# Vivado block design ps, xc7z020clg484-1, Vivado 2017.1
# (continued, part 3 of 4)
current_bd_instance /RX/rx_10

# ---- hierarchy /RX/rx_11 ----
current_bd_instance /RX/rx_11
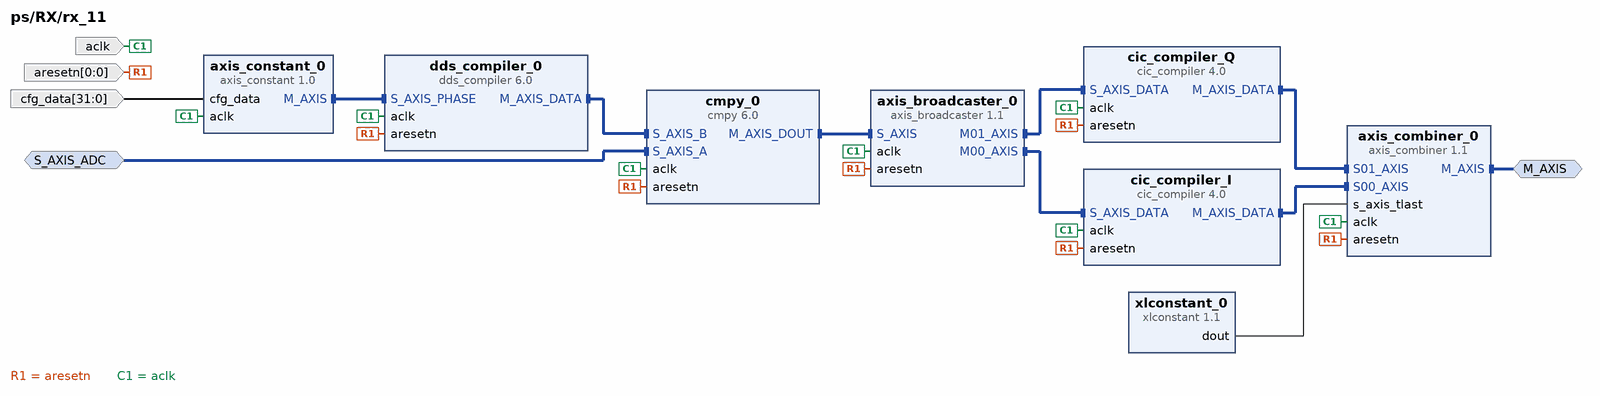
[diagram p17: block diagram inside /RX/rx_11]
create_bd_intf_pin -mode Slave -vlnv xilinx.com:interface:axis_rtl:1.0 S_AXIS_ADC
create_bd_intf_pin -mode Master -vlnv xilinx.com:interface:axis_rtl:1.0 M_AXIS
create_bd_pin -dir I aclk
create_bd_pin -dir I -from 0 -to 0 aresetn
create_bd_pin -dir I -from 31 -to 0 cfg_data

create_bd_cell -type ip -vlnv pavel-demin:user:axis_constant:1.0 axis_constant_0
create_bd_cell -type ip -vlnv xilinx.com:ip:axis_broadcaster:1.1 axis_broadcaster_0
set_property -dict [list \
  CONFIG.M_TDATA_NUM_BYTES 3 \
  CONFIG.S_TDATA_NUM_BYTES 8 \
  CONFIG.M00_TDATA_REMAP {tdata[23:0]} \
  CONFIG.M01_TDATA_REMAP {tdata[55:32]} \
] [get_bd_cells axis_broadcaster_0]
create_bd_cell -type ip -vlnv xilinx.com:ip:axis_combiner:1.1 axis_combiner_0
set_property -dict {CONFIG.TDATA_NUM_BYTES 3 CONFIG.HAS_TLAST 1} [get_bd_cells axis_combiner_0]
create_bd_cell -type ip -vlnv xilinx.com:ip:cic_compiler:4.0 cic_compiler_I
set_property -dict [list \
  CONFIG.Filter_Type Decimation \
  CONFIG.Number_Of_Stages 5 \
  CONFIG.Fixed_Or_Initial_Rate 32 \
  CONFIG.Minimum_Rate 32 \
  CONFIG.Maximum_Rate 32 \
  CONFIG.Input_Sample_Frequency 125 \
  CONFIG.Clock_Frequency 125 \
  CONFIG.SamplePeriod 1 \
  CONFIG.Input_Data_Width 24 \
  CONFIG.Quantization Truncation \
  CONFIG.Output_Data_Width 24 \
  CONFIG.Use_Xtreme_DSP_Slice false \
  CONFIG.HAS_ARESETN true \
  CONFIG.HAS_DOUT_TREADY true \
] [get_bd_cells cic_compiler_I]
create_bd_cell -type ip -vlnv xilinx.com:ip:cic_compiler:4.0 cic_compiler_Q
set_property -dict [list \
  CONFIG.Filter_Type Decimation \
  CONFIG.Number_Of_Stages 5 \
  CONFIG.Fixed_Or_Initial_Rate 32 \
  CONFIG.Minimum_Rate 32 \
  CONFIG.Maximum_Rate 32 \
  CONFIG.Input_Sample_Frequency 125 \
  CONFIG.Clock_Frequency 125 \
  CONFIG.SamplePeriod 1 \
  CONFIG.Input_Data_Width 24 \
  CONFIG.Quantization Truncation \
  CONFIG.Output_Data_Width 24 \
  CONFIG.Use_Xtreme_DSP_Slice false \
  CONFIG.HAS_ARESETN true \
  CONFIG.HAS_DOUT_TREADY true \
] [get_bd_cells cic_compiler_Q]
create_bd_cell -type ip -vlnv xilinx.com:ip:cmpy:6.0 cmpy_0
set_property -dict [list \
  CONFIG.APortWidth 16 \
  CONFIG.BPortWidth 24 \
  CONFIG.FlowControl Blocking \
  CONFIG.RoundMode Truncate \
  CONFIG.OutputWidth 25 \
  CONFIG.MinimumLatency 9 \
  CONFIG.ARESETN true \
] [get_bd_cells cmpy_0]
create_bd_cell -type ip -vlnv xilinx.com:ip:dds_compiler:6.0 dds_compiler_0
set_property -dict [list \
  CONFIG.DDS_Clock_Rate 125 \
  CONFIG.Spurious_Free_Dynamic_Range 138 \
  CONFIG.Frequency_Resolution 0.2 \
  CONFIG.Noise_Shaping Auto \
  CONFIG.Phase_Width 30 \
  CONFIG.Output_Width 24 \
  CONFIG.Phase_Increment Streaming \
  CONFIG.Negative_Sine true \
  CONFIG.Has_Phase_Out false \
  CONFIG.DATA_Has_TLAST Not_Required \
  CONFIG.Has_TREADY true \
  CONFIG.S_PHASE_Has_TUSER Not_Required \
  CONFIG.M_DATA_Has_TUSER Not_Required \
  CONFIG.Latency 16 \
  CONFIG.Has_ARESETn true \
  CONFIG.Output_Frequency1 0 \
  CONFIG.PINC1 0 \
] [get_bd_cells dds_compiler_0]
create_bd_cell -type ip -vlnv xilinx.com:ip:xlconstant:1.1 xlconstant_0
set_property -dict {CONFIG.CONST_WIDTH 2 CONFIG.CONST_VAL 2} [get_bd_cells xlconstant_0]

# ---- hierarchy /RX/rx_12 ----
current_bd_instance /RX/rx_12
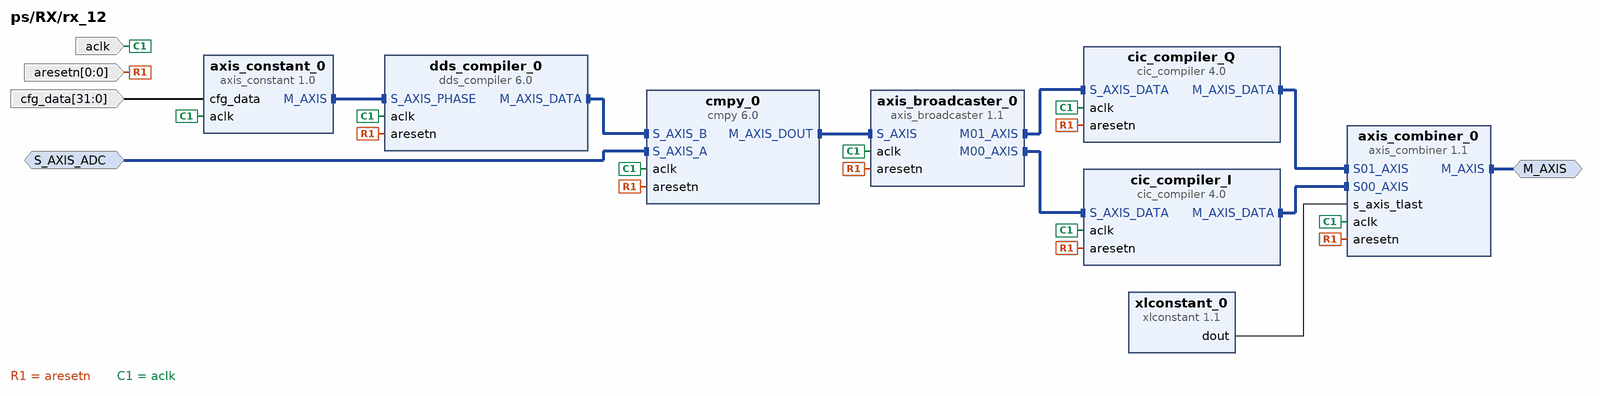
[diagram p18: block diagram inside /RX/rx_12]
create_bd_intf_pin -mode Slave -vlnv xilinx.com:interface:axis_rtl:1.0 S_AXIS_ADC
create_bd_intf_pin -mode Master -vlnv xilinx.com:interface:axis_rtl:1.0 M_AXIS
create_bd_pin -dir I aclk
create_bd_pin -dir I -from 0 -to 0 aresetn
create_bd_pin -dir I -from 31 -to 0 cfg_data

create_bd_cell -type ip -vlnv pavel-demin:user:axis_constant:1.0 axis_constant_0
create_bd_cell -type ip -vlnv xilinx.com:ip:axis_broadcaster:1.1 axis_broadcaster_0
set_property -dict [list \
  CONFIG.M_TDATA_NUM_BYTES 3 \
  CONFIG.S_TDATA_NUM_BYTES 8 \
  CONFIG.M00_TDATA_REMAP {tdata[23:0]} \
  CONFIG.M01_TDATA_REMAP {tdata[55:32]} \
] [get_bd_cells axis_broadcaster_0]
create_bd_cell -type ip -vlnv xilinx.com:ip:axis_combiner:1.1 axis_combiner_0
set_property -dict {CONFIG.TDATA_NUM_BYTES 3 CONFIG.HAS_TLAST 1} [get_bd_cells axis_combiner_0]
create_bd_cell -type ip -vlnv xilinx.com:ip:cic_compiler:4.0 cic_compiler_I
set_property -dict [list \
  CONFIG.Filter_Type Decimation \
  CONFIG.Number_Of_Stages 5 \
  CONFIG.Fixed_Or_Initial_Rate 32 \
  CONFIG.Minimum_Rate 32 \
  CONFIG.Maximum_Rate 32 \
  CONFIG.Input_Sample_Frequency 125 \
  CONFIG.Clock_Frequency 125 \
  CONFIG.SamplePeriod 1 \
  CONFIG.Input_Data_Width 24 \
  CONFIG.Quantization Truncation \
  CONFIG.Output_Data_Width 24 \
  CONFIG.Use_Xtreme_DSP_Slice false \
  CONFIG.HAS_ARESETN true \
  CONFIG.HAS_DOUT_TREADY true \
] [get_bd_cells cic_compiler_I]
create_bd_cell -type ip -vlnv xilinx.com:ip:cic_compiler:4.0 cic_compiler_Q
set_property -dict [list \
  CONFIG.Filter_Type Decimation \
  CONFIG.Number_Of_Stages 5 \
  CONFIG.Fixed_Or_Initial_Rate 32 \
  CONFIG.Minimum_Rate 32 \
  CONFIG.Maximum_Rate 32 \
  CONFIG.Input_Sample_Frequency 125 \
  CONFIG.Clock_Frequency 125 \
  CONFIG.SamplePeriod 1 \
  CONFIG.Input_Data_Width 24 \
  CONFIG.Quantization Truncation \
  CONFIG.Output_Data_Width 24 \
  CONFIG.Use_Xtreme_DSP_Slice false \
  CONFIG.HAS_ARESETN true \
  CONFIG.HAS_DOUT_TREADY true \
] [get_bd_cells cic_compiler_Q]
create_bd_cell -type ip -vlnv xilinx.com:ip:cmpy:6.0 cmpy_0
set_property -dict [list \
  CONFIG.APortWidth 16 \
  CONFIG.BPortWidth 24 \
  CONFIG.FlowControl Blocking \
  CONFIG.RoundMode Truncate \
  CONFIG.OutputWidth 25 \
  CONFIG.MinimumLatency 9 \
  CONFIG.ARESETN true \
] [get_bd_cells cmpy_0]
create_bd_cell -type ip -vlnv xilinx.com:ip:dds_compiler:6.0 dds_compiler_0
set_property -dict [list \
  CONFIG.DDS_Clock_Rate 125 \
  CONFIG.Spurious_Free_Dynamic_Range 138 \
  CONFIG.Frequency_Resolution 0.2 \
  CONFIG.Noise_Shaping Auto \
  CONFIG.Phase_Width 30 \
  CONFIG.Output_Width 24 \
  CONFIG.Phase_Increment Streaming \
  CONFIG.Negative_Sine true \
  CONFIG.Has_Phase_Out false \
  CONFIG.DATA_Has_TLAST Not_Required \
  CONFIG.Has_TREADY true \
  CONFIG.S_PHASE_Has_TUSER Not_Required \
  CONFIG.M_DATA_Has_TUSER Not_Required \
  CONFIG.Latency 16 \
  CONFIG.Has_ARESETn true \
  CONFIG.Output_Frequency1 0 \
  CONFIG.PINC1 0 \
] [get_bd_cells dds_compiler_0]
create_bd_cell -type ip -vlnv xilinx.com:ip:xlconstant:1.1 xlconstant_0
set_property -dict {CONFIG.CONST_WIDTH 2 CONFIG.CONST_VAL 2} [get_bd_cells xlconstant_0]

# ---- hierarchy /RX/rx_13 ----
current_bd_instance /RX/rx_13
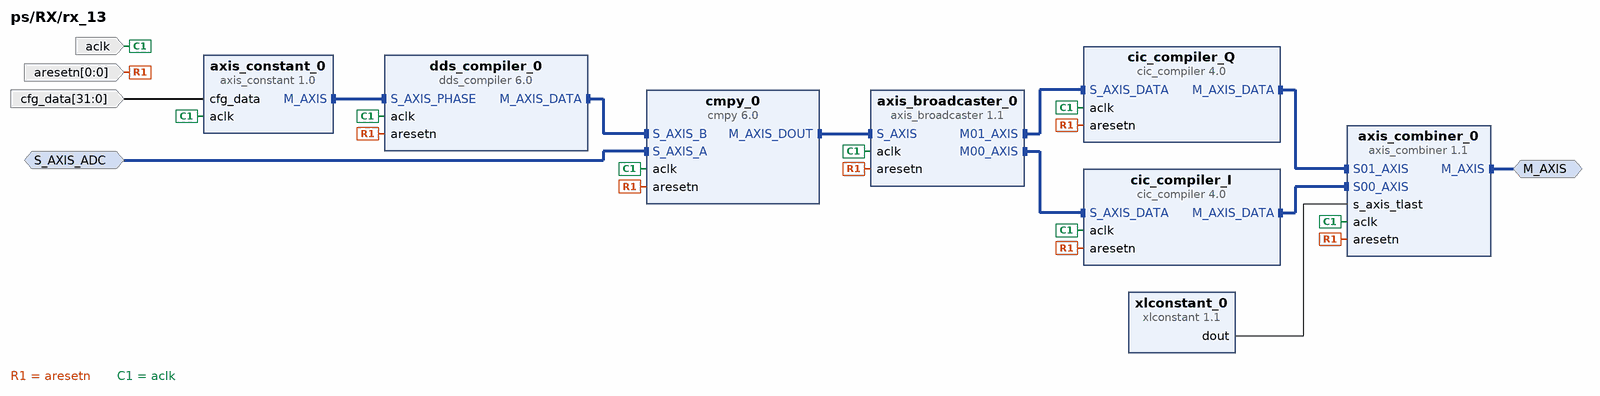
[diagram p19: block diagram inside /RX/rx_13]
create_bd_intf_pin -mode Slave -vlnv xilinx.com:interface:axis_rtl:1.0 S_AXIS_ADC
create_bd_intf_pin -mode Master -vlnv xilinx.com:interface:axis_rtl:1.0 M_AXIS
create_bd_pin -dir I aclk
create_bd_pin -dir I -from 0 -to 0 aresetn
create_bd_pin -dir I -from 31 -to 0 cfg_data

create_bd_cell -type ip -vlnv pavel-demin:user:axis_constant:1.0 axis_constant_0
create_bd_cell -type ip -vlnv xilinx.com:ip:axis_broadcaster:1.1 axis_broadcaster_0
set_property -dict [list \
  CONFIG.M_TDATA_NUM_BYTES 3 \
  CONFIG.S_TDATA_NUM_BYTES 8 \
  CONFIG.M00_TDATA_REMAP {tdata[23:0]} \
  CONFIG.M01_TDATA_REMAP {tdata[55:32]} \
] [get_bd_cells axis_broadcaster_0]
create_bd_cell -type ip -vlnv xilinx.com:ip:axis_combiner:1.1 axis_combiner_0
set_property -dict {CONFIG.TDATA_NUM_BYTES 3 CONFIG.HAS_TLAST 1} [get_bd_cells axis_combiner_0]
create_bd_cell -type ip -vlnv xilinx.com:ip:cic_compiler:4.0 cic_compiler_I
set_property -dict [list \
  CONFIG.Filter_Type Decimation \
  CONFIG.Number_Of_Stages 5 \
  CONFIG.Fixed_Or_Initial_Rate 32 \
  CONFIG.Minimum_Rate 32 \
  CONFIG.Maximum_Rate 32 \
  CONFIG.Input_Sample_Frequency 125 \
  CONFIG.Clock_Frequency 125 \
  CONFIG.SamplePeriod 1 \
  CONFIG.Input_Data_Width 24 \
  CONFIG.Quantization Truncation \
  CONFIG.Output_Data_Width 24 \
  CONFIG.Use_Xtreme_DSP_Slice false \
  CONFIG.HAS_ARESETN true \
  CONFIG.HAS_DOUT_TREADY true \
] [get_bd_cells cic_compiler_I]
create_bd_cell -type ip -vlnv xilinx.com:ip:cic_compiler:4.0 cic_compiler_Q
set_property -dict [list \
  CONFIG.Filter_Type Decimation \
  CONFIG.Number_Of_Stages 5 \
  CONFIG.Fixed_Or_Initial_Rate 32 \
  CONFIG.Minimum_Rate 32 \
  CONFIG.Maximum_Rate 32 \
  CONFIG.Input_Sample_Frequency 125 \
  CONFIG.Clock_Frequency 125 \
  CONFIG.SamplePeriod 1 \
  CONFIG.Input_Data_Width 24 \
  CONFIG.Quantization Truncation \
  CONFIG.Output_Data_Width 24 \
  CONFIG.Use_Xtreme_DSP_Slice false \
  CONFIG.HAS_ARESETN true \
  CONFIG.HAS_DOUT_TREADY true \
] [get_bd_cells cic_compiler_Q]
create_bd_cell -type ip -vlnv xilinx.com:ip:cmpy:6.0 cmpy_0
set_property -dict [list \
  CONFIG.APortWidth 16 \
  CONFIG.BPortWidth 24 \
  CONFIG.FlowControl Blocking \
  CONFIG.RoundMode Truncate \
  CONFIG.OutputWidth 25 \
  CONFIG.MinimumLatency 9 \
  CONFIG.ARESETN true \
] [get_bd_cells cmpy_0]
create_bd_cell -type ip -vlnv xilinx.com:ip:dds_compiler:6.0 dds_compiler_0
set_property -dict [list \
  CONFIG.DDS_Clock_Rate 125 \
  CONFIG.Spurious_Free_Dynamic_Range 138 \
  CONFIG.Frequency_Resolution 0.2 \
  CONFIG.Noise_Shaping Auto \
  CONFIG.Phase_Width 30 \
  CONFIG.Output_Width 24 \
  CONFIG.Phase_Increment Streaming \
  CONFIG.Negative_Sine true \
  CONFIG.Has_Phase_Out false \
  CONFIG.DATA_Has_TLAST Not_Required \
  CONFIG.Has_TREADY true \
  CONFIG.S_PHASE_Has_TUSER Not_Required \
  CONFIG.M_DATA_Has_TUSER Not_Required \
  CONFIG.Latency 16 \
  CONFIG.Has_ARESETn true \
  CONFIG.Output_Frequency1 0 \
  CONFIG.PINC1 0 \
] [get_bd_cells dds_compiler_0]
create_bd_cell -type ip -vlnv xilinx.com:ip:xlconstant:1.1 xlconstant_0
set_property -dict {CONFIG.CONST_WIDTH 2 CONFIG.CONST_VAL 2} [get_bd_cells xlconstant_0]

# ---- hierarchy /RX/rx_14 ----
current_bd_instance /RX/rx_14
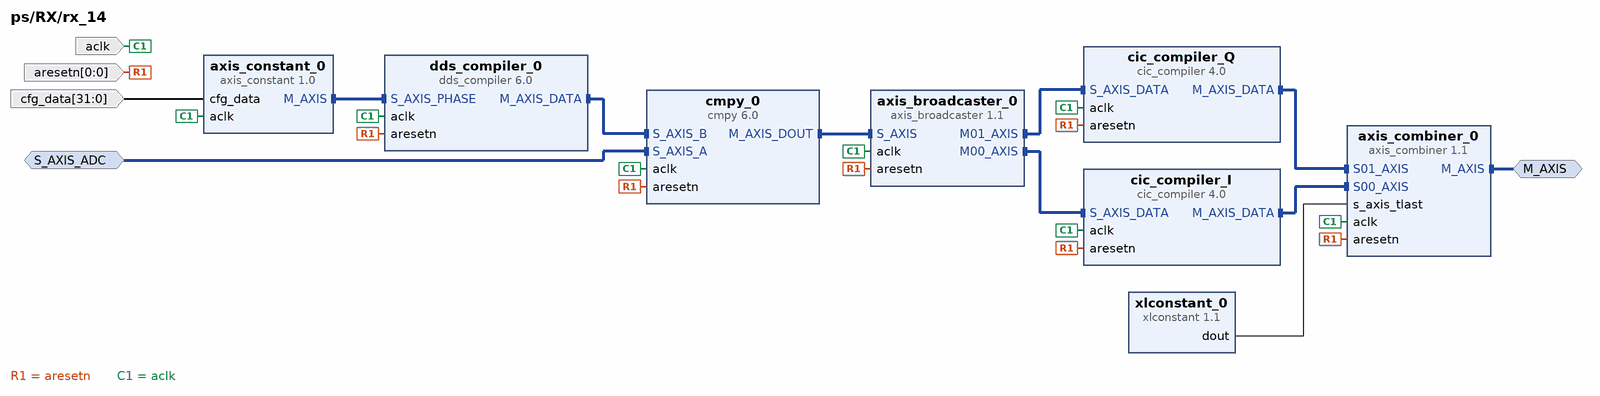
[diagram p20: block diagram inside /RX/rx_14]
create_bd_intf_pin -mode Slave -vlnv xilinx.com:interface:axis_rtl:1.0 S_AXIS_ADC
create_bd_intf_pin -mode Master -vlnv xilinx.com:interface:axis_rtl:1.0 M_AXIS
create_bd_pin -dir I aclk
create_bd_pin -dir I -from 0 -to 0 aresetn
create_bd_pin -dir I -from 31 -to 0 cfg_data

create_bd_cell -type ip -vlnv pavel-demin:user:axis_constant:1.0 axis_constant_0
create_bd_cell -type ip -vlnv xilinx.com:ip:axis_broadcaster:1.1 axis_broadcaster_0
set_property -dict [list \
  CONFIG.M_TDATA_NUM_BYTES 3 \
  CONFIG.S_TDATA_NUM_BYTES 8 \
  CONFIG.M00_TDATA_REMAP {tdata[23:0]} \
  CONFIG.M01_TDATA_REMAP {tdata[55:32]} \
] [get_bd_cells axis_broadcaster_0]
create_bd_cell -type ip -vlnv xilinx.com:ip:axis_combiner:1.1 axis_combiner_0
set_property -dict {CONFIG.TDATA_NUM_BYTES 3 CONFIG.HAS_TLAST 1} [get_bd_cells axis_combiner_0]
create_bd_cell -type ip -vlnv xilinx.com:ip:cic_compiler:4.0 cic_compiler_I
set_property -dict [list \
  CONFIG.Filter_Type Decimation \
  CONFIG.Number_Of_Stages 5 \
  CONFIG.Fixed_Or_Initial_Rate 32 \
  CONFIG.Minimum_Rate 32 \
  CONFIG.Maximum_Rate 32 \
  CONFIG.Input_Sample_Frequency 125 \
  CONFIG.Clock_Frequency 125 \
  CONFIG.SamplePeriod 1 \
  CONFIG.Input_Data_Width 24 \
  CONFIG.Quantization Truncation \
  CONFIG.Output_Data_Width 24 \
  CONFIG.Use_Xtreme_DSP_Slice false \
  CONFIG.HAS_ARESETN true \
  CONFIG.HAS_DOUT_TREADY true \
] [get_bd_cells cic_compiler_I]
create_bd_cell -type ip -vlnv xilinx.com:ip:cic_compiler:4.0 cic_compiler_Q
set_property -dict [list \
  CONFIG.Filter_Type Decimation \
  CONFIG.Number_Of_Stages 5 \
  CONFIG.Fixed_Or_Initial_Rate 32 \
  CONFIG.Minimum_Rate 32 \
  CONFIG.Maximum_Rate 32 \
  CONFIG.Input_Sample_Frequency 125 \
  CONFIG.Clock_Frequency 125 \
  CONFIG.SamplePeriod 1 \
  CONFIG.Input_Data_Width 24 \
  CONFIG.Quantization Truncation \
  CONFIG.Output_Data_Width 24 \
  CONFIG.Use_Xtreme_DSP_Slice false \
  CONFIG.HAS_ARESETN true \
  CONFIG.HAS_DOUT_TREADY true \
] [get_bd_cells cic_compiler_Q]
create_bd_cell -type ip -vlnv xilinx.com:ip:cmpy:6.0 cmpy_0
set_property -dict [list \
  CONFIG.APortWidth 16 \
  CONFIG.BPortWidth 24 \
  CONFIG.FlowControl Blocking \
  CONFIG.RoundMode Truncate \
  CONFIG.OutputWidth 25 \
  CONFIG.MinimumLatency 9 \
  CONFIG.ARESETN true \
] [get_bd_cells cmpy_0]
create_bd_cell -type ip -vlnv xilinx.com:ip:dds_compiler:6.0 dds_compiler_0
set_property -dict [list \
  CONFIG.DDS_Clock_Rate 125 \
  CONFIG.Spurious_Free_Dynamic_Range 138 \
  CONFIG.Frequency_Resolution 0.2 \
  CONFIG.Noise_Shaping Auto \
  CONFIG.Phase_Width 30 \
  CONFIG.Output_Width 24 \
  CONFIG.Phase_Increment Streaming \
  CONFIG.Negative_Sine true \
  CONFIG.Has_Phase_Out false \
  CONFIG.DATA_Has_TLAST Not_Required \
  CONFIG.Has_TREADY true \
  CONFIG.S_PHASE_Has_TUSER Not_Required \
  CONFIG.M_DATA_Has_TUSER Not_Required \
  CONFIG.Latency 16 \
  CONFIG.Has_ARESETn true \
  CONFIG.Output_Frequency1 0 \
  CONFIG.PINC1 0 \
] [get_bd_cells dds_compiler_0]
create_bd_cell -type ip -vlnv xilinx.com:ip:xlconstant:1.1 xlconstant_0
set_property -dict {CONFIG.CONST_WIDTH 2 CONFIG.CONST_VAL 2} [get_bd_cells xlconstant_0]

# ---- hierarchy /RX/rx_15 ----
current_bd_instance /RX/rx_15
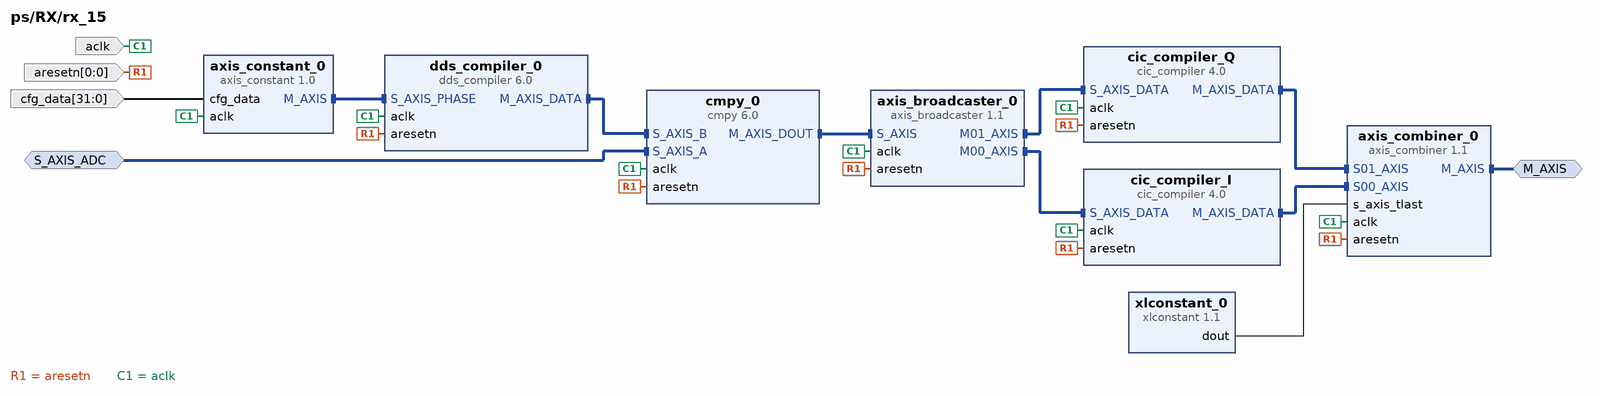
[diagram p21: block diagram inside /RX/rx_15]
create_bd_intf_pin -mode Slave -vlnv xilinx.com:interface:axis_rtl:1.0 S_AXIS_ADC
create_bd_intf_pin -mode Master -vlnv xilinx.com:interface:axis_rtl:1.0 M_AXIS
create_bd_pin -dir I aclk
create_bd_pin -dir I -from 0 -to 0 aresetn
create_bd_pin -dir I -from 31 -to 0 cfg_data

create_bd_cell -type ip -vlnv pavel-demin:user:axis_constant:1.0 axis_constant_0
create_bd_cell -type ip -vlnv xilinx.com:ip:axis_broadcaster:1.1 axis_broadcaster_0
set_property -dict [list \
  CONFIG.M_TDATA_NUM_BYTES 3 \
  CONFIG.S_TDATA_NUM_BYTES 8 \
  CONFIG.M00_TDATA_REMAP {tdata[23:0]} \
  CONFIG.M01_TDATA_REMAP {tdata[55:32]} \
] [get_bd_cells axis_broadcaster_0]
create_bd_cell -type ip -vlnv xilinx.com:ip:axis_combiner:1.1 axis_combiner_0
set_property -dict {CONFIG.TDATA_NUM_BYTES 3 CONFIG.HAS_TLAST 1} [get_bd_cells axis_combiner_0]
create_bd_cell -type ip -vlnv xilinx.com:ip:cic_compiler:4.0 cic_compiler_I
set_property -dict [list \
  CONFIG.Filter_Type Decimation \
  CONFIG.Number_Of_Stages 5 \
  CONFIG.Fixed_Or_Initial_Rate 32 \
  CONFIG.Minimum_Rate 32 \
  CONFIG.Maximum_Rate 32 \
  CONFIG.Input_Sample_Frequency 125 \
  CONFIG.Clock_Frequency 125 \
  CONFIG.SamplePeriod 1 \
  CONFIG.Input_Data_Width 24 \
  CONFIG.Quantization Truncation \
  CONFIG.Output_Data_Width 24 \
  CONFIG.Use_Xtreme_DSP_Slice false \
  CONFIG.HAS_ARESETN true \
  CONFIG.HAS_DOUT_TREADY true \
] [get_bd_cells cic_compiler_I]
create_bd_cell -type ip -vlnv xilinx.com:ip:cic_compiler:4.0 cic_compiler_Q
set_property -dict [list \
  CONFIG.Filter_Type Decimation \
  CONFIG.Number_Of_Stages 5 \
  CONFIG.Fixed_Or_Initial_Rate 32 \
  CONFIG.Minimum_Rate 32 \
  CONFIG.Maximum_Rate 32 \
  CONFIG.Input_Sample_Frequency 125 \
  CONFIG.Clock_Frequency 125 \
  CONFIG.SamplePeriod 1 \
  CONFIG.Input_Data_Width 24 \
  CONFIG.Quantization Truncation \
  CONFIG.Output_Data_Width 24 \
  CONFIG.Use_Xtreme_DSP_Slice false \
  CONFIG.HAS_ARESETN true \
  CONFIG.HAS_DOUT_TREADY true \
] [get_bd_cells cic_compiler_Q]
create_bd_cell -type ip -vlnv xilinx.com:ip:cmpy:6.0 cmpy_0
set_property -dict [list \
  CONFIG.APortWidth 16 \
  CONFIG.BPortWidth 24 \
  CONFIG.FlowControl Blocking \
  CONFIG.RoundMode Truncate \
  CONFIG.OutputWidth 25 \
  CONFIG.MinimumLatency 9 \
  CONFIG.ARESETN true \
] [get_bd_cells cmpy_0]
create_bd_cell -type ip -vlnv xilinx.com:ip:dds_compiler:6.0 dds_compiler_0
set_property -dict [list \
  CONFIG.DDS_Clock_Rate 125 \
  CONFIG.Spurious_Free_Dynamic_Range 138 \
  CONFIG.Frequency_Resolution 0.2 \
  CONFIG.Noise_Shaping Auto \
  CONFIG.Phase_Width 30 \
  CONFIG.Output_Width 24 \
  CONFIG.Phase_Increment Streaming \
  CONFIG.Negative_Sine true \
  CONFIG.Has_Phase_Out false \
  CONFIG.DATA_Has_TLAST Not_Required \
  CONFIG.Has_TREADY true \
  CONFIG.S_PHASE_Has_TUSER Not_Required \
  CONFIG.M_DATA_Has_TUSER Not_Required \
  CONFIG.Latency 16 \
  CONFIG.Has_ARESETn true \
  CONFIG.Output_Frequency1 0 \
  CONFIG.PINC1 0 \
] [get_bd_cells dds_compiler_0]
create_bd_cell -type ip -vlnv xilinx.com:ip:xlconstant:1.1 xlconstant_0
set_property -dict {CONFIG.CONST_WIDTH 2 CONFIG.CONST_VAL 2} [get_bd_cells xlconstant_0]

# ---- connections ----

current_bd_instance /TX
connect_bd_intf_net [get_bd_intf_pins cic_compiler_0/M_AXIS_DATA] [get_bd_intf_pins axis_combiner_0/S00_AXIS]
connect_bd_intf_net [get_bd_intf_pins cic_compiler_1/M_AXIS_DATA] [get_bd_intf_pins axis_combiner_0/S01_AXIS]
connect_bd_intf_net [get_bd_intf_pins axis_combiner_0/M_AXIS] [get_bd_intf_pins cmpy_0/S_AXIS_A]
connect_bd_intf_net [get_bd_intf_pins axis_broadcaster_0/M00_AXIS] [get_bd_intf_pins cic_compiler_0/S_AXIS_DATA]
connect_bd_intf_net [get_bd_intf_pins axis_broadcaster_0/M01_AXIS] [get_bd_intf_pins cic_compiler_1/S_AXIS_DATA]
connect_bd_intf_net [get_bd_intf_pins dds_compiler_0/M_AXIS_DATA] [get_bd_intf_pins cmpy_0/S_AXIS_B]
connect_bd_intf_net [get_bd_intf_pins axis_variable_0/M_AXIS] [get_bd_intf_pins cic_compiler_0/S_AXIS_CONFIG]
connect_bd_intf_net [get_bd_intf_pins axis_variable_1/M_AXIS] [get_bd_intf_pins cic_compiler_1/S_AXIS_CONFIG]
connect_bd_intf_net [get_bd_intf_pins axis_constant_0/M_AXIS] [get_bd_intf_pins dds_compiler_0/S_AXIS_PHASE]
connect_bd_intf_net [get_bd_intf_pins axis_broadcaster_0/S_AXIS] [get_bd_intf_pins fir_compiler_0/M_AXIS_DATA]
connect_bd_intf_net [get_bd_intf_pins cmpy_0/M_AXIS_DOUT] [get_bd_intf_pins axis_broadcaster_1/S_AXIS]
connect_bd_intf_net [get_bd_intf_pins S_AXI_CFG] [get_bd_intf_pins axi_cfg_register_0/S_AXI]
connect_bd_intf_net [get_bd_intf_pins S_AXIS_TX] [get_bd_intf_pins fir_compiler_0/S_AXIS_DATA]
connect_bd_intf_net [get_bd_intf_pins M00_AXIS_TX] [get_bd_intf_pins axis_broadcaster_1/M00_AXIS]
connect_bd_intf_net [get_bd_intf_pins M01_AXIS_TX] [get_bd_intf_pins axis_broadcaster_1/M01_AXIS]
connect_bd_net [get_bd_pins aclk] \
  [get_bd_pins axis_variable_1/aclk] [get_bd_pins axis_variable_0/aclk] [get_bd_pins axis_constant_0/aclk] \
  [get_bd_pins axi_cfg_register_0/aclk] [get_bd_pins axis_broadcaster_0/aclk] [get_bd_pins axis_broadcaster_1/aclk] \
  [get_bd_pins axis_combiner_0/aclk] [get_bd_pins cic_compiler_0/aclk] [get_bd_pins cic_compiler_1/aclk] \
  [get_bd_pins cmpy_0/aclk] [get_bd_pins dds_compiler_0/aclk] [get_bd_pins fir_compiler_0/aclk]
connect_bd_net [get_bd_pins xlslice_0/Dout] [get_bd_pins axis_variable_0/cfg_data] [get_bd_pins axis_variable_1/cfg_data]
connect_bd_net [get_bd_pins axi_cfg_register_0/cfg_data] [get_bd_pins xlslice_0/Din] [get_bd_pins xlslice_1/Din]
connect_bd_net [get_bd_pins xlslice_1/Dout] [get_bd_pins axis_constant_0/cfg_data]
connect_bd_net [get_bd_pins aresetn] \
  [get_bd_pins axis_variable_0/aresetn] [get_bd_pins axis_variable_1/aresetn] [get_bd_pins axi_cfg_register_0/aresetn] \
  [get_bd_pins axis_broadcaster_0/aresetn] [get_bd_pins axis_broadcaster_1/aresetn] [get_bd_pins axis_combiner_0/aresetn] \
  [get_bd_pins cic_compiler_0/aresetn] [get_bd_pins cic_compiler_1/aresetn] [get_bd_pins cmpy_0/aresetn] \
  [get_bd_pins dds_compiler_0/aresetn] [get_bd_pins fir_compiler_0/aresetn]

current_bd_instance /RX
connect_bd_intf_net [get_bd_intf_pins RX_Connect/M00_AXIS] [get_bd_intf_pins rx_0/S_AXIS_ADC]
connect_bd_intf_net [get_bd_intf_pins cic_compiler_0/M_AXIS_DATA] [get_bd_intf_pins fir_compiler_0/S_AXIS_DATA]
connect_bd_intf_net [get_bd_intf_pins axis_combiner_1/M_AXIS] [get_bd_intf_pins axis_dwidth_converter_0/S_AXIS]
connect_bd_intf_net [get_bd_intf_pins rx_0/M_AXIS] [get_bd_intf_pins axis_combiner_1/S00_AXIS]
connect_bd_intf_net [get_bd_intf_pins rx_1/M_AXIS] [get_bd_intf_pins axis_combiner_1/S01_AXIS]
connect_bd_intf_net [get_bd_intf_pins rx_2/M_AXIS] [get_bd_intf_pins axis_combiner_1/S02_AXIS]
connect_bd_intf_net [get_bd_intf_pins rx_3/M_AXIS] [get_bd_intf_pins axis_combiner_1/S03_AXIS]
connect_bd_intf_net [get_bd_intf_pins rx_4/M_AXIS] [get_bd_intf_pins axis_combiner_1/S04_AXIS]
connect_bd_intf_net [get_bd_intf_pins rx_5/M_AXIS] [get_bd_intf_pins axis_combiner_1/S05_AXIS]
connect_bd_intf_net [get_bd_intf_pins rx_6/M_AXIS] [get_bd_intf_pins axis_combiner_1/S06_AXIS]
connect_bd_intf_net [get_bd_intf_pins rx_7/M_AXIS] [get_bd_intf_pins axis_combiner_1/S07_AXIS]
connect_bd_intf_net [get_bd_intf_pins RX_Connect/M00_AXIS7] [get_bd_intf_pins rx_7/S_AXIS_ADC]
connect_bd_intf_net [get_bd_intf_pins RX_Connect/M00_AXIS6] [get_bd_intf_pins rx_6/S_AXIS_ADC]
connect_bd_intf_net [get_bd_intf_pins RX_Connect/M00_AXIS5] [get_bd_intf_pins rx_5/S_AXIS_ADC]
connect_bd_intf_net [get_bd_intf_pins RX_Connect/M00_AXIS1] [get_bd_intf_pins rx_1/S_AXIS_ADC]
connect_bd_intf_net [get_bd_intf_pins RX_Connect/M00_AXIS4] [get_bd_intf_pins rx_4/S_AXIS_ADC]
connect_bd_intf_net [get_bd_intf_pins RX_Connect/M00_AXIS3] [get_bd_intf_pins rx_3/S_AXIS_ADC]
connect_bd_intf_net [get_bd_intf_pins RX_Connect/M00_AXIS2] [get_bd_intf_pins rx_2/S_AXIS_ADC]
connect_bd_intf_net [get_bd_intf_pins cic_compiler_1/M_AXIS_DATA] [get_bd_intf_pins fir_compiler_1/S_AXIS_DATA]
connect_bd_intf_net [get_bd_intf_pins axis_broadcaster_3/S_AXIS] [get_bd_intf_pins axis_dwidth_converter_0/M_AXIS]
connect_bd_intf_net [get_bd_intf_pins axis_broadcaster_3/M00_AXIS] [get_bd_intf_pins cic_compiler_0/S_AXIS_DATA]
connect_bd_intf_net [get_bd_intf_pins axis_broadcaster_3/M01_AXIS] [get_bd_intf_pins cic_compiler_1/S_AXIS_DATA]
connect_bd_intf_net [get_bd_intf_pins axis_data_fifo_0/S_AXIS] [get_bd_intf_pins axis_packetizer_0/M_AXIS]
connect_bd_intf_net [get_bd_intf_pins axis_data_fifo_0/M_AXIS] [get_bd_intf_pins axis_switch/S00_AXIS]
connect_bd_intf_net [get_bd_intf_pins axis_packetizer_1/M_AXIS] [get_bd_intf_pins axis_data_fifo_1/S_AXIS]
connect_bd_intf_net [get_bd_intf_pins axis_data_fifo_1/M_AXIS] [get_bd_intf_pins axis_switch/S01_AXIS]
connect_bd_intf_net [get_bd_intf_pins fir_compiler_0/M_AXIS_DATA] [get_bd_intf_pins axis_packetizer_0/S_AXIS]
connect_bd_intf_net [get_bd_intf_pins fir_compiler_1/M_AXIS_DATA] [get_bd_intf_pins axis_packetizer_1/S_AXIS]
connect_bd_intf_net [get_bd_intf_pins rx_8/M_AXIS] [get_bd_intf_pins axis_combiner_1/S08_AXIS]
connect_bd_intf_net [get_bd_intf_pins rx_9/M_AXIS] [get_bd_intf_pins axis_combiner_1/S09_AXIS]
connect_bd_intf_net [get_bd_intf_pins rx_10/M_AXIS] [get_bd_intf_pins axis_combiner_1/S10_AXIS]
connect_bd_intf_net [get_bd_intf_pins axis_combiner_1/S11_AXIS] [get_bd_intf_pins rx_11/M_AXIS]
connect_bd_intf_net [get_bd_intf_pins rx_12/M_AXIS] [get_bd_intf_pins axis_combiner_1/S12_AXIS]
connect_bd_intf_net [get_bd_intf_pins axis_combiner_1/S13_AXIS] [get_bd_intf_pins rx_13/M_AXIS]
connect_bd_intf_net [get_bd_intf_pins rx_14/M_AXIS] [get_bd_intf_pins axis_combiner_1/S14_AXIS]
connect_bd_intf_net [get_bd_intf_pins axis_combiner_1/S15_AXIS] [get_bd_intf_pins rx_15/M_AXIS]
connect_bd_intf_net [get_bd_intf_pins rx_8/S_AXIS_ADC] [get_bd_intf_pins RX_Connect/M00_AXIS8]
connect_bd_intf_net [get_bd_intf_pins rx_9/S_AXIS_ADC] [get_bd_intf_pins RX_Connect/M00_AXIS9]
connect_bd_intf_net [get_bd_intf_pins rx_10/S_AXIS_ADC] [get_bd_intf_pins RX_Connect/M00_AXIS10]
connect_bd_intf_net [get_bd_intf_pins rx_11/S_AXIS_ADC] [get_bd_intf_pins RX_Connect/M00_AXIS11]
connect_bd_intf_net [get_bd_intf_pins rx_12/S_AXIS_ADC] [get_bd_intf_pins RX_Connect/M00_AXIS12]
connect_bd_intf_net [get_bd_intf_pins rx_13/S_AXIS_ADC] [get_bd_intf_pins RX_Connect/M00_AXIS13]
connect_bd_intf_net [get_bd_intf_pins rx_14/S_AXIS_ADC] [get_bd_intf_pins RX_Connect/M00_AXIS14]
connect_bd_intf_net [get_bd_intf_pins rx_15/S_AXIS_ADC] [get_bd_intf_pins RX_Connect/M00_AXIS15]
connect_bd_intf_net [get_bd_intf_pins M00_AXIS] [get_bd_intf_pins axis_switch/M00_AXIS]
connect_bd_intf_net [get_bd_intf_pins ADC_I] [get_bd_intf_pins RX_Connect/S_AXIS2]
connect_bd_intf_net [get_bd_intf_pins ADC_Q] [get_bd_intf_pins RX_Connect/S_AXIS1]
connect_bd_intf_net [get_bd_intf_pins ADC_IQ] [get_bd_intf_pins RX_Connect/S_AXIS]
connect_bd_intf_net [get_bd_intf_pins S00_AXI] [get_bd_intf_pins RX_Connect/S00_AXI]
connect_bd_intf_net [get_bd_intf_pins S_AXI] [get_bd_intf_pins axi_cfg_register_rx_freq/S_AXI]
connect_bd_net -net processing_system7_0_FCLK_CLK0 [get_bd_pins aclk] \
  [get_bd_pins axis_packetizer_0/aclk] [get_bd_pins axis_packetizer_1/aclk] [get_bd_pins axi_cfg_register_rx_freq/aclk] \
  [get_bd_pins axis_broadcaster_3/aclk] [get_bd_pins axis_combiner_1/aclk] [get_bd_pins axis_data_fifo_0/s_axis_aclk] \
  [get_bd_pins axis_data_fifo_1/s_axis_aclk] [get_bd_pins axis_dwidth_converter_0/aclk] [get_bd_pins axis_switch/aclk] \
  [get_bd_pins cic_compiler_0/aclk] [get_bd_pins cic_compiler_1/aclk] [get_bd_pins fir_compiler_0/aclk] \
  [get_bd_pins fir_compiler_1/aclk] [get_bd_pins rx_0/aclk] [get_bd_pins rx_1/aclk] [get_bd_pins rx_2/aclk] \
  [get_bd_pins rx_3/aclk] [get_bd_pins rx_4/aclk] [get_bd_pins rx_5/aclk] [get_bd_pins rx_6/aclk] [get_bd_pins rx_7/aclk] \
  [get_bd_pins RX_Connect/aclk] [get_bd_pins rx_8/aclk] [get_bd_pins rx_9/aclk] [get_bd_pins rx_10/aclk] \
  [get_bd_pins rx_11/aclk] [get_bd_pins rx_12/aclk] [get_bd_pins rx_13/aclk] [get_bd_pins rx_14/aclk] \
  [get_bd_pins rx_15/aclk]
connect_bd_net -net proc_sys_reset_0_peripheral_aresetn [get_bd_pins aresetn] \
  [get_bd_pins axis_packetizer_0/aresetn] [get_bd_pins axis_packetizer_1/aresetn] \
  [get_bd_pins axi_cfg_register_rx_freq/aresetn] [get_bd_pins axis_broadcaster_3/aresetn] \
  [get_bd_pins axis_combiner_1/aresetn] [get_bd_pins axis_data_fifo_0/s_axis_aresetn] \
  [get_bd_pins axis_data_fifo_1/s_axis_aresetn] [get_bd_pins axis_dwidth_converter_0/aresetn] \
  [get_bd_pins axis_switch/aresetn] [get_bd_pins cic_compiler_0/aresetn] [get_bd_pins cic_compiler_1/aresetn] \
  [get_bd_pins fir_compiler_0/aresetn] [get_bd_pins fir_compiler_1/aresetn] [get_bd_pins rx_0/aresetn] \
  [get_bd_pins rx_7/aresetn] [get_bd_pins rx_1/aresetn] [get_bd_pins rx_2/aresetn] [get_bd_pins rx_3/aresetn] \
  [get_bd_pins rx_4/aresetn] [get_bd_pins rx_5/aresetn] [get_bd_pins rx_6/aresetn] [get_bd_pins RX_Connect/aresetn] \
  [get_bd_pins rx_8/aresetn] [get_bd_pins rx_9/aresetn] [get_bd_pins rx_10/aresetn] [get_bd_pins rx_11/aresetn] \
  [get_bd_pins rx_12/aresetn] [get_bd_pins rx_13/aresetn] [get_bd_pins rx_14/aresetn] [get_bd_pins rx_15/aresetn]
connect_bd_net [get_bd_pins xlconstant_0/dout] [get_bd_pins axis_switch/s_req_suppress]
connect_bd_net [get_bd_pins xlconstant_3/dout] [get_bd_pins axis_packetizer_0/cfg_data]
connect_bd_net [get_bd_pins xlconstant_4/dout] [get_bd_pins axis_packetizer_1/cfg_data]
connect_bd_net [get_bd_pins xlslice_0/Dout] [get_bd_pins xlconcat_0/In0]
connect_bd_net [get_bd_pins xlslice_1/Dout] [get_bd_pins xlconcat_0/In2]
connect_bd_net [get_bd_pins xlconstant_1/dout] [get_bd_pins xlconcat_0/In1]
connect_bd_net [get_bd_pins xlconstant_2/dout] [get_bd_pins xlconcat_0/In3]
connect_bd_net [get_bd_pins xlconcat_0/dout] [get_bd_pins axis_switch/s_axis_tdata]
connect_bd_net [get_bd_pins axis_data_fifo_0/m_axis_tdata] [get_bd_pins xlslice_0/Din]
connect_bd_net [get_bd_pins axis_data_fifo_1/m_axis_tdata] [get_bd_pins xlslice_1/Din]
connect_bd_net -net axi_cfg_register_0_cfg_data [get_bd_pins axi_cfg_register_rx_freq/cfg_data] \
  [get_bd_pins xlslice_rx_0/Din] [get_bd_pins xlslice_rx_10/Din] [get_bd_pins xlslice_rx_11/Din] \
  [get_bd_pins xlslice_rx_12/Din] [get_bd_pins xlslice_rx_13/Din] [get_bd_pins xlslice_rx_14/Din] \
  [get_bd_pins xlslice_rx_15/Din] [get_bd_pins xlslice_rx_1/Din] [get_bd_pins xlslice_rx_2/Din] \
  [get_bd_pins xlslice_rx_3/Din] [get_bd_pins xlslice_rx_4/Din] [get_bd_pins xlslice_rx_5/Din] [get_bd_pins xlslice_rx_6/Din] \
  [get_bd_pins xlslice_rx_7/Din] [get_bd_pins xlslice_rx_8/Din] [get_bd_pins xlslice_rx_9/Din]
connect_bd_net -net cfg_data_1 [get_bd_pins xlslice_rx_0/Dout] [get_bd_pins rx_0/cfg_data]
connect_bd_net [get_bd_pins xlslice_rx_1/Dout] [get_bd_pins rx_1/cfg_data]
connect_bd_net [get_bd_pins xlslice_rx_2/Dout] [get_bd_pins rx_2/cfg_data]
connect_bd_net [get_bd_pins xlslice_rx_3/Dout] [get_bd_pins rx_3/cfg_data]
connect_bd_net [get_bd_pins xlslice_rx_4/Dout] [get_bd_pins rx_4/cfg_data]
connect_bd_net [get_bd_pins xlslice_rx_5/Dout] [get_bd_pins rx_5/cfg_data]
connect_bd_net [get_bd_pins xlslice_rx_6/Dout] [get_bd_pins rx_6/cfg_data]
connect_bd_net [get_bd_pins xlslice_rx_7/Dout] [get_bd_pins rx_7/cfg_data]
connect_bd_net [get_bd_pins xlslice_rx_15/Dout] [get_bd_pins rx_15/cfg_data]
connect_bd_net [get_bd_pins xlslice_rx_14/Dout] [get_bd_pins rx_14/cfg_data]
connect_bd_net [get_bd_pins xlslice_rx_13/Dout] [get_bd_pins rx_13/cfg_data]
connect_bd_net [get_bd_pins xlslice_rx_12/Dout] [get_bd_pins rx_12/cfg_data]
connect_bd_net [get_bd_pins xlslice_rx_11/Dout] [get_bd_pins rx_11/cfg_data]
connect_bd_net [get_bd_pins xlslice_rx_10/Dout] [get_bd_pins rx_10/cfg_data]
connect_bd_net [get_bd_pins xlslice_rx_9/Dout] [get_bd_pins rx_9/cfg_data]
connect_bd_net [get_bd_pins xlslice_rx_8/Dout] [get_bd_pins rx_8/cfg_data]

current_bd_instance /RX/rx_0
connect_bd_intf_net [get_bd_intf_pins dds_compiler_0/M_AXIS_DATA] [get_bd_intf_pins cmpy_0/S_AXIS_B]
connect_bd_intf_net [get_bd_intf_pins axis_constant_0/M_AXIS] [get_bd_intf_pins dds_compiler_0/S_AXIS_PHASE]
connect_bd_intf_net [get_bd_intf_pins cmpy_0/M_AXIS_DOUT] [get_bd_intf_pins axis_broadcaster_0/S_AXIS]
connect_bd_intf_net [get_bd_intf_pins cic_compiler_I/S_AXIS_DATA] [get_bd_intf_pins axis_broadcaster_0/M00_AXIS]
connect_bd_intf_net [get_bd_intf_pins axis_broadcaster_0/M01_AXIS] [get_bd_intf_pins cic_compiler_Q/S_AXIS_DATA]
connect_bd_intf_net [get_bd_intf_pins cic_compiler_I/M_AXIS_DATA] [get_bd_intf_pins axis_combiner_0/S00_AXIS]
connect_bd_intf_net [get_bd_intf_pins cic_compiler_Q/M_AXIS_DATA] [get_bd_intf_pins axis_combiner_0/S01_AXIS]
connect_bd_intf_net [get_bd_intf_pins S_AXIS_ADC] [get_bd_intf_pins cmpy_0/S_AXIS_A]
connect_bd_intf_net [get_bd_intf_pins M_AXIS] [get_bd_intf_pins axis_combiner_0/M_AXIS]
connect_bd_net [get_bd_pins aresetn] \
  [get_bd_pins axis_broadcaster_0/aresetn] [get_bd_pins axis_combiner_0/aresetn] [get_bd_pins cic_compiler_I/aresetn] \
  [get_bd_pins cic_compiler_Q/aresetn] [get_bd_pins cmpy_0/aresetn] [get_bd_pins dds_compiler_0/aresetn]
connect_bd_net [get_bd_pins aclk] \
  [get_bd_pins axis_constant_0/aclk] [get_bd_pins axis_broadcaster_0/aclk] [get_bd_pins axis_combiner_0/aclk] \
  [get_bd_pins cic_compiler_I/aclk] [get_bd_pins cic_compiler_Q/aclk] [get_bd_pins cmpy_0/aclk] \
  [get_bd_pins dds_compiler_0/aclk]
connect_bd_net [get_bd_pins cfg_data] [get_bd_pins axis_constant_0/cfg_data]

current_bd_instance /RX/rx_1
connect_bd_intf_net [get_bd_intf_pins dds_compiler_0/M_AXIS_DATA] [get_bd_intf_pins cmpy_0/S_AXIS_B]
connect_bd_intf_net [get_bd_intf_pins axis_constant_0/M_AXIS] [get_bd_intf_pins dds_compiler_0/S_AXIS_PHASE]
connect_bd_intf_net [get_bd_intf_pins cmpy_0/M_AXIS_DOUT] [get_bd_intf_pins axis_broadcaster_0/S_AXIS]
connect_bd_intf_net [get_bd_intf_pins cic_compiler_I/S_AXIS_DATA] [get_bd_intf_pins axis_broadcaster_0/M00_AXIS]
connect_bd_intf_net [get_bd_intf_pins axis_broadcaster_0/M01_AXIS] [get_bd_intf_pins cic_compiler_Q/S_AXIS_DATA]
connect_bd_intf_net [get_bd_intf_pins cic_compiler_I/M_AXIS_DATA] [get_bd_intf_pins axis_combiner_0/S00_AXIS]
connect_bd_intf_net [get_bd_intf_pins cic_compiler_Q/M_AXIS_DATA] [get_bd_intf_pins axis_combiner_0/S01_AXIS]
connect_bd_intf_net [get_bd_intf_pins S_AXIS_ADC] [get_bd_intf_pins cmpy_0/S_AXIS_A]
connect_bd_intf_net [get_bd_intf_pins M_AXIS] [get_bd_intf_pins axis_combiner_0/M_AXIS]
connect_bd_net [get_bd_pins aresetn] \
  [get_bd_pins axis_broadcaster_0/aresetn] [get_bd_pins axis_combiner_0/aresetn] [get_bd_pins cic_compiler_I/aresetn] \
  [get_bd_pins cic_compiler_Q/aresetn] [get_bd_pins cmpy_0/aresetn] [get_bd_pins dds_compiler_0/aresetn]
connect_bd_net [get_bd_pins aclk] \
  [get_bd_pins axis_constant_0/aclk] [get_bd_pins axis_broadcaster_0/aclk] [get_bd_pins axis_combiner_0/aclk] \
  [get_bd_pins cic_compiler_I/aclk] [get_bd_pins cic_compiler_Q/aclk] [get_bd_pins cmpy_0/aclk] \
  [get_bd_pins dds_compiler_0/aclk]
connect_bd_net [get_bd_pins cfg_data] [get_bd_pins axis_constant_0/cfg_data]

current_bd_instance /RX/rx_2
connect_bd_intf_net [get_bd_intf_pins dds_compiler_0/M_AXIS_DATA] [get_bd_intf_pins cmpy_0/S_AXIS_B]
connect_bd_intf_net [get_bd_intf_pins axis_constant_0/M_AXIS] [get_bd_intf_pins dds_compiler_0/S_AXIS_PHASE]
connect_bd_intf_net [get_bd_intf_pins cmpy_0/M_AXIS_DOUT] [get_bd_intf_pins axis_broadcaster_0/S_AXIS]
connect_bd_intf_net [get_bd_intf_pins cic_compiler_I/S_AXIS_DATA] [get_bd_intf_pins axis_broadcaster_0/M00_AXIS]
connect_bd_intf_net [get_bd_intf_pins axis_broadcaster_0/M01_AXIS] [get_bd_intf_pins cic_compiler_Q/S_AXIS_DATA]
connect_bd_intf_net [get_bd_intf_pins cic_compiler_I/M_AXIS_DATA] [get_bd_intf_pins axis_combiner_0/S00_AXIS]
connect_bd_intf_net [get_bd_intf_pins cic_compiler_Q/M_AXIS_DATA] [get_bd_intf_pins axis_combiner_0/S01_AXIS]
connect_bd_intf_net [get_bd_intf_pins S_AXIS_ADC] [get_bd_intf_pins cmpy_0/S_AXIS_A]
connect_bd_intf_net [get_bd_intf_pins M_AXIS] [get_bd_intf_pins axis_combiner_0/M_AXIS]
connect_bd_net [get_bd_pins aresetn] \
  [get_bd_pins axis_broadcaster_0/aresetn] [get_bd_pins axis_combiner_0/aresetn] [get_bd_pins cic_compiler_I/aresetn] \
  [get_bd_pins cic_compiler_Q/aresetn] [get_bd_pins cmpy_0/aresetn] [get_bd_pins dds_compiler_0/aresetn]
connect_bd_net [get_bd_pins aclk] \
  [get_bd_pins axis_constant_0/aclk] [get_bd_pins axis_broadcaster_0/aclk] [get_bd_pins axis_combiner_0/aclk] \
  [get_bd_pins cic_compiler_I/aclk] [get_bd_pins cic_compiler_Q/aclk] [get_bd_pins cmpy_0/aclk] \
  [get_bd_pins dds_compiler_0/aclk]
connect_bd_net [get_bd_pins cfg_data] [get_bd_pins axis_constant_0/cfg_data]

current_bd_instance /RX/rx_3
connect_bd_intf_net [get_bd_intf_pins dds_compiler_0/M_AXIS_DATA] [get_bd_intf_pins cmpy_0/S_AXIS_B]
connect_bd_intf_net [get_bd_intf_pins axis_constant_0/M_AXIS] [get_bd_intf_pins dds_compiler_0/S_AXIS_PHASE]
connect_bd_intf_net [get_bd_intf_pins cmpy_0/M_AXIS_DOUT] [get_bd_intf_pins axis_broadcaster_0/S_AXIS]
connect_bd_intf_net [get_bd_intf_pins cic_compiler_I/S_AXIS_DATA] [get_bd_intf_pins axis_broadcaster_0/M00_AXIS]
connect_bd_intf_net [get_bd_intf_pins axis_broadcaster_0/M01_AXIS] [get_bd_intf_pins cic_compiler_Q/S_AXIS_DATA]
connect_bd_intf_net [get_bd_intf_pins cic_compiler_I/M_AXIS_DATA] [get_bd_intf_pins axis_combiner_0/S00_AXIS]
connect_bd_intf_net [get_bd_intf_pins cic_compiler_Q/M_AXIS_DATA] [get_bd_intf_pins axis_combiner_0/S01_AXIS]
connect_bd_intf_net [get_bd_intf_pins S_AXIS_ADC] [get_bd_intf_pins cmpy_0/S_AXIS_A]
connect_bd_intf_net [get_bd_intf_pins M_AXIS] [get_bd_intf_pins axis_combiner_0/M_AXIS]
connect_bd_net [get_bd_pins aresetn] \
  [get_bd_pins axis_broadcaster_0/aresetn] [get_bd_pins axis_combiner_0/aresetn] [get_bd_pins cic_compiler_I/aresetn] \
  [get_bd_pins cic_compiler_Q/aresetn] [get_bd_pins cmpy_0/aresetn] [get_bd_pins dds_compiler_0/aresetn]
connect_bd_net [get_bd_pins aclk] \
  [get_bd_pins axis_constant_0/aclk] [get_bd_pins axis_broadcaster_0/aclk] [get_bd_pins axis_combiner_0/aclk] \
  [get_bd_pins cic_compiler_I/aclk] [get_bd_pins cic_compiler_Q/aclk] [get_bd_pins cmpy_0/aclk] \
  [get_bd_pins dds_compiler_0/aclk]
connect_bd_net [get_bd_pins cfg_data] [get_bd_pins axis_constant_0/cfg_data]

current_bd_instance /RX/rx_4
connect_bd_intf_net [get_bd_intf_pins dds_compiler_0/M_AXIS_DATA] [get_bd_intf_pins cmpy_0/S_AXIS_B]
connect_bd_intf_net [get_bd_intf_pins axis_constant_0/M_AXIS] [get_bd_intf_pins dds_compiler_0/S_AXIS_PHASE]
connect_bd_intf_net [get_bd_intf_pins cmpy_0/M_AXIS_DOUT] [get_bd_intf_pins axis_broadcaster_0/S_AXIS]
connect_bd_intf_net [get_bd_intf_pins cic_compiler_I/S_AXIS_DATA] [get_bd_intf_pins axis_broadcaster_0/M00_AXIS]
connect_bd_intf_net [get_bd_intf_pins axis_broadcaster_0/M01_AXIS] [get_bd_intf_pins cic_compiler_Q/S_AXIS_DATA]
connect_bd_intf_net [get_bd_intf_pins cic_compiler_I/M_AXIS_DATA] [get_bd_intf_pins axis_combiner_0/S00_AXIS]
connect_bd_intf_net [get_bd_intf_pins cic_compiler_Q/M_AXIS_DATA] [get_bd_intf_pins axis_combiner_0/S01_AXIS]
connect_bd_intf_net [get_bd_intf_pins S_AXIS_ADC] [get_bd_intf_pins cmpy_0/S_AXIS_A]
connect_bd_intf_net [get_bd_intf_pins M_AXIS] [get_bd_intf_pins axis_combiner_0/M_AXIS]
connect_bd_net [get_bd_pins aresetn] \
  [get_bd_pins axis_broadcaster_0/aresetn] [get_bd_pins axis_combiner_0/aresetn] [get_bd_pins cic_compiler_I/aresetn] \
  [get_bd_pins cic_compiler_Q/aresetn] [get_bd_pins cmpy_0/aresetn] [get_bd_pins dds_compiler_0/aresetn]
connect_bd_net [get_bd_pins aclk] \
  [get_bd_pins axis_constant_0/aclk] [get_bd_pins axis_broadcaster_0/aclk] [get_bd_pins axis_combiner_0/aclk] \
  [get_bd_pins cic_compiler_I/aclk] [get_bd_pins cic_compiler_Q/aclk] [get_bd_pins cmpy_0/aclk] \
  [get_bd_pins dds_compiler_0/aclk]
connect_bd_net [get_bd_pins cfg_data] [get_bd_pins axis_constant_0/cfg_data]

current_bd_instance /RX/rx_5
connect_bd_intf_net [get_bd_intf_pins dds_compiler_0/M_AXIS_DATA] [get_bd_intf_pins cmpy_0/S_AXIS_B]
connect_bd_intf_net [get_bd_intf_pins axis_constant_0/M_AXIS] [get_bd_intf_pins dds_compiler_0/S_AXIS_PHASE]
connect_bd_intf_net [get_bd_intf_pins cmpy_0/M_AXIS_DOUT] [get_bd_intf_pins axis_broadcaster_0/S_AXIS]
connect_bd_intf_net [get_bd_intf_pins cic_compiler_I/S_AXIS_DATA] [get_bd_intf_pins axis_broadcaster_0/M00_AXIS]
connect_bd_intf_net [get_bd_intf_pins axis_broadcaster_0/M01_AXIS] [get_bd_intf_pins cic_compiler_Q/S_AXIS_DATA]
connect_bd_intf_net [get_bd_intf_pins cic_compiler_I/M_AXIS_DATA] [get_bd_intf_pins axis_combiner_0/S00_AXIS]
connect_bd_intf_net [get_bd_intf_pins cic_compiler_Q/M_AXIS_DATA] [get_bd_intf_pins axis_combiner_0/S01_AXIS]
connect_bd_intf_net [get_bd_intf_pins S_AXIS_ADC] [get_bd_intf_pins cmpy_0/S_AXIS_A]
connect_bd_intf_net [get_bd_intf_pins M_AXIS] [get_bd_intf_pins axis_combiner_0/M_AXIS]
connect_bd_net [get_bd_pins aresetn] \
  [get_bd_pins axis_broadcaster_0/aresetn] [get_bd_pins axis_combiner_0/aresetn] [get_bd_pins cic_compiler_I/aresetn] \
  [get_bd_pins cic_compiler_Q/aresetn] [get_bd_pins cmpy_0/aresetn] [get_bd_pins dds_compiler_0/aresetn]
connect_bd_net [get_bd_pins aclk] \
  [get_bd_pins axis_constant_0/aclk] [get_bd_pins axis_broadcaster_0/aclk] [get_bd_pins axis_combiner_0/aclk] \
  [get_bd_pins cic_compiler_I/aclk] [get_bd_pins cic_compiler_Q/aclk] [get_bd_pins cmpy_0/aclk] \
  [get_bd_pins dds_compiler_0/aclk]
connect_bd_net [get_bd_pins cfg_data] [get_bd_pins axis_constant_0/cfg_data]

current_bd_instance /RX/rx_6
connect_bd_intf_net [get_bd_intf_pins dds_compiler_0/M_AXIS_DATA] [get_bd_intf_pins cmpy_0/S_AXIS_B]
connect_bd_intf_net [get_bd_intf_pins axis_constant_0/M_AXIS] [get_bd_intf_pins dds_compiler_0/S_AXIS_PHASE]
connect_bd_intf_net [get_bd_intf_pins cmpy_0/M_AXIS_DOUT] [get_bd_intf_pins axis_broadcaster_0/S_AXIS]
connect_bd_intf_net [get_bd_intf_pins cic_compiler_I/S_AXIS_DATA] [get_bd_intf_pins axis_broadcaster_0/M00_AXIS]
connect_bd_intf_net [get_bd_intf_pins axis_broadcaster_0/M01_AXIS] [get_bd_intf_pins cic_compiler_Q/S_AXIS_DATA]
connect_bd_intf_net [get_bd_intf_pins cic_compiler_I/M_AXIS_DATA] [get_bd_intf_pins axis_combiner_0/S00_AXIS]
connect_bd_intf_net [get_bd_intf_pins cic_compiler_Q/M_AXIS_DATA] [get_bd_intf_pins axis_combiner_0/S01_AXIS]
connect_bd_intf_net [get_bd_intf_pins S_AXIS_ADC] [get_bd_intf_pins cmpy_0/S_AXIS_A]
connect_bd_intf_net [get_bd_intf_pins M_AXIS] [get_bd_intf_pins axis_combiner_0/M_AXIS]
connect_bd_net [get_bd_pins aresetn] \
  [get_bd_pins axis_broadcaster_0/aresetn] [get_bd_pins axis_combiner_0/aresetn] [get_bd_pins cic_compiler_I/aresetn] \
  [get_bd_pins cic_compiler_Q/aresetn] [get_bd_pins cmpy_0/aresetn] [get_bd_pins dds_compiler_0/aresetn]
connect_bd_net [get_bd_pins aclk] \
  [get_bd_pins axis_constant_0/aclk] [get_bd_pins axis_broadcaster_0/aclk] [get_bd_pins axis_combiner_0/aclk] \
  [get_bd_pins cic_compiler_I/aclk] [get_bd_pins cic_compiler_Q/aclk] [get_bd_pins cmpy_0/aclk] \
  [get_bd_pins dds_compiler_0/aclk]
connect_bd_net [get_bd_pins cfg_data] [get_bd_pins axis_constant_0/cfg_data]

current_bd_instance /RX/rx_7
connect_bd_intf_net [get_bd_intf_pins dds_compiler_0/M_AXIS_DATA] [get_bd_intf_pins cmpy_0/S_AXIS_B]
connect_bd_intf_net [get_bd_intf_pins axis_constant_0/M_AXIS] [get_bd_intf_pins dds_compiler_0/S_AXIS_PHASE]
connect_bd_intf_net [get_bd_intf_pins cmpy_0/M_AXIS_DOUT] [get_bd_intf_pins axis_broadcaster_0/S_AXIS]
connect_bd_intf_net [get_bd_intf_pins cic_compiler_I/S_AXIS_DATA] [get_bd_intf_pins axis_broadcaster_0/M00_AXIS]
connect_bd_intf_net [get_bd_intf_pins axis_broadcaster_0/M01_AXIS] [get_bd_intf_pins cic_compiler_Q/S_AXIS_DATA]
connect_bd_intf_net [get_bd_intf_pins cic_compiler_I/M_AXIS_DATA] [get_bd_intf_pins axis_combiner_0/S00_AXIS]
connect_bd_intf_net [get_bd_intf_pins cic_compiler_Q/M_AXIS_DATA] [get_bd_intf_pins axis_combiner_0/S01_AXIS]
connect_bd_intf_net [get_bd_intf_pins S_AXIS_ADC] [get_bd_intf_pins cmpy_0/S_AXIS_A]
connect_bd_intf_net [get_bd_intf_pins M_AXIS] [get_bd_intf_pins axis_combiner_0/M_AXIS]
connect_bd_net [get_bd_pins aresetn] \
  [get_bd_pins axis_broadcaster_0/aresetn] [get_bd_pins axis_combiner_0/aresetn] [get_bd_pins cic_compiler_I/aresetn] \
  [get_bd_pins cic_compiler_Q/aresetn] [get_bd_pins cmpy_0/aresetn] [get_bd_pins dds_compiler_0/aresetn]
connect_bd_net [get_bd_pins aclk] \
  [get_bd_pins axis_constant_0/aclk] [get_bd_pins axis_broadcaster_0/aclk] [get_bd_pins axis_combiner_0/aclk] \
  [get_bd_pins cic_compiler_I/aclk] [get_bd_pins cic_compiler_Q/aclk] [get_bd_pins cmpy_0/aclk] \
  [get_bd_pins dds_compiler_0/aclk]
connect_bd_net [get_bd_pins xlconstant_0/dout] [get_bd_pins axis_combiner_0/s_axis_tlast]
connect_bd_net [get_bd_pins cfg_data] [get_bd_pins axis_constant_0/cfg_data]

current_bd_instance /RX/RX_Connect
connect_bd_intf_net [get_bd_intf_pins axis_broadcaster_0/M00_AXIS] [get_bd_intf_pins axis_switch_0/S00_AXIS]
connect_bd_intf_net [get_bd_intf_pins axis_broadcaster_2/M00_AXIS] [get_bd_intf_pins axis_switch_0/S01_AXIS]
connect_bd_intf_net [get_bd_intf_pins axis_broadcaster_1/M00_AXIS] [get_bd_intf_pins axis_switch_0/S02_AXIS]
connect_bd_intf_net [get_bd_intf_pins axis_broadcaster_0/M01_AXIS] [get_bd_intf_pins axis_switch_1/S00_AXIS]
connect_bd_intf_net [get_bd_intf_pins axis_broadcaster_2/M01_AXIS] [get_bd_intf_pins axis_switch_1/S01_AXIS]
connect_bd_intf_net [get_bd_intf_pins axis_broadcaster_1/M01_AXIS] [get_bd_intf_pins axis_switch_1/S02_AXIS]
connect_bd_intf_net [get_bd_intf_pins axis_broadcaster_0/M02_AXIS] [get_bd_intf_pins axis_switch_2/S00_AXIS]
connect_bd_intf_net [get_bd_intf_pins axis_broadcaster_2/M02_AXIS] [get_bd_intf_pins axis_switch_2/S01_AXIS]
connect_bd_intf_net [get_bd_intf_pins axis_switch_2/S02_AXIS] [get_bd_intf_pins axis_broadcaster_1/M02_AXIS]
connect_bd_intf_net [get_bd_intf_pins axis_broadcaster_1/M03_AXIS] [get_bd_intf_pins axis_switch_3/S02_AXIS]
connect_bd_intf_net [get_bd_intf_pins axis_broadcaster_1/M04_AXIS] [get_bd_intf_pins axis_switch_4/S02_AXIS]
connect_bd_intf_net [get_bd_intf_pins axis_broadcaster_1/M05_AXIS] [get_bd_intf_pins axis_switch_5/S02_AXIS]
connect_bd_intf_net [get_bd_intf_pins axis_switch_6/S02_AXIS] [get_bd_intf_pins axis_broadcaster_1/M06_AXIS]
connect_bd_intf_net [get_bd_intf_pins axis_broadcaster_1/M07_AXIS] [get_bd_intf_pins axis_switch_7/S02_AXIS]
connect_bd_intf_net [get_bd_intf_pins axis_broadcaster_0/M03_AXIS] [get_bd_intf_pins axis_switch_3/S00_AXIS]
connect_bd_intf_net [get_bd_intf_pins axis_broadcaster_2/M03_AXIS] [get_bd_intf_pins axis_switch_3/S01_AXIS]
connect_bd_intf_net [get_bd_intf_pins axis_switch_4/S00_AXIS] [get_bd_intf_pins axis_broadcaster_0/M04_AXIS]
connect_bd_intf_net [get_bd_intf_pins axis_broadcaster_2/M04_AXIS] [get_bd_intf_pins axis_switch_4/S01_AXIS]
connect_bd_intf_net [get_bd_intf_pins axis_broadcaster_2/M05_AXIS] [get_bd_intf_pins axis_switch_5/S01_AXIS]
connect_bd_intf_net [get_bd_intf_pins axis_switch_6/S01_AXIS] [get_bd_intf_pins axis_broadcaster_2/M06_AXIS]
connect_bd_intf_net [get_bd_intf_pins axis_switch_7/S01_AXIS] [get_bd_intf_pins axis_broadcaster_2/M07_AXIS]
connect_bd_intf_net [get_bd_intf_pins axis_broadcaster_0/M05_AXIS] [get_bd_intf_pins axis_switch_5/S00_AXIS]
connect_bd_intf_net [get_bd_intf_pins axis_switch_6/S00_AXIS] [get_bd_intf_pins axis_broadcaster_0/M06_AXIS]
connect_bd_intf_net [get_bd_intf_pins axis_switch_7/S00_AXIS] [get_bd_intf_pins axis_broadcaster_0/M07_AXIS]
connect_bd_intf_net [get_bd_intf_pins axis_switch_0/S_AXI_CTRL] [get_bd_intf_pins axi_interconnect_0/M00_AXI]
connect_bd_intf_net [get_bd_intf_pins axis_switch_1/S_AXI_CTRL] [get_bd_intf_pins axi_interconnect_0/M01_AXI]
connect_bd_intf_net [get_bd_intf_pins axis_switch_2/S_AXI_CTRL] [get_bd_intf_pins axi_interconnect_0/M02_AXI]
connect_bd_intf_net [get_bd_intf_pins axis_switch_3/S_AXI_CTRL] [get_bd_intf_pins axi_interconnect_0/M03_AXI]
connect_bd_intf_net [get_bd_intf_pins axis_switch_4/S_AXI_CTRL] [get_bd_intf_pins axi_interconnect_0/M04_AXI]
connect_bd_intf_net [get_bd_intf_pins axis_switch_6/S_AXI_CTRL] [get_bd_intf_pins axi_interconnect_0/M06_AXI]
connect_bd_intf_net [get_bd_intf_pins axi_interconnect_0/M05_AXI] [get_bd_intf_pins axis_switch_5/S_AXI_CTRL]
connect_bd_intf_net [get_bd_intf_pins axis_switch_7/S_AXI_CTRL] [get_bd_intf_pins axi_interconnect_0/M07_AXI]
connect_bd_intf_net [get_bd_intf_pins axis_broadcaster_0/M08_AXIS] [get_bd_intf_pins axis_switch_8/S00_AXIS]
connect_bd_intf_net [get_bd_intf_pins axis_switch_9/S00_AXIS] [get_bd_intf_pins axis_broadcaster_0/M09_AXIS]
connect_bd_intf_net [get_bd_intf_pins axis_broadcaster_0/M10_AXIS] [get_bd_intf_pins axis_switch_10/S00_AXIS]
connect_bd_intf_net [get_bd_intf_pins axis_switch_11/S00_AXIS] [get_bd_intf_pins axis_broadcaster_0/M11_AXIS]
connect_bd_intf_net [get_bd_intf_pins axis_broadcaster_0/M12_AXIS] [get_bd_intf_pins axis_switch_12/S00_AXIS]
connect_bd_intf_net [get_bd_intf_pins axis_switch_13/S00_AXIS] [get_bd_intf_pins axis_broadcaster_0/M13_AXIS]
connect_bd_intf_net [get_bd_intf_pins axis_broadcaster_0/M14_AXIS] [get_bd_intf_pins axis_switch_14/S00_AXIS]
connect_bd_intf_net [get_bd_intf_pins axis_switch_15/S00_AXIS] [get_bd_intf_pins axis_broadcaster_0/M15_AXIS]
connect_bd_intf_net [get_bd_intf_pins axis_switch_8/S01_AXIS] [get_bd_intf_pins axis_broadcaster_2/M08_AXIS]
connect_bd_intf_net [get_bd_intf_pins axis_broadcaster_2/M09_AXIS] [get_bd_intf_pins axis_switch_9/S01_AXIS]
connect_bd_intf_net [get_bd_intf_pins axis_switch_10/S01_AXIS] [get_bd_intf_pins axis_broadcaster_2/M10_AXIS]
connect_bd_intf_net [get_bd_intf_pins axis_broadcaster_2/M11_AXIS] [get_bd_intf_pins axis_switch_11/S01_AXIS]
connect_bd_intf_net [get_bd_intf_pins axis_switch_12/S01_AXIS] [get_bd_intf_pins axis_broadcaster_2/M12_AXIS]
connect_bd_intf_net [get_bd_intf_pins axis_broadcaster_2/M13_AXIS] [get_bd_intf_pins axis_switch_13/S01_AXIS]
connect_bd_intf_net [get_bd_intf_pins axis_switch_14/S01_AXIS] [get_bd_intf_pins axis_broadcaster_2/M14_AXIS]
connect_bd_intf_net [get_bd_intf_pins axis_broadcaster_2/M15_AXIS] [get_bd_intf_pins axis_switch_15/S01_AXIS]
connect_bd_intf_net [get_bd_intf_pins axis_broadcaster_1/M08_AXIS] [get_bd_intf_pins axis_switch_8/S02_AXIS]
connect_bd_intf_net [get_bd_intf_pins axis_broadcaster_1/M09_AXIS] [get_bd_intf_pins axis_switch_9/S02_AXIS]
connect_bd_intf_net [get_bd_intf_pins axis_broadcaster_1/M10_AXIS] [get_bd_intf_pins axis_switch_10/S02_AXIS]
connect_bd_intf_net [get_bd_intf_pins axis_switch_11/S02_AXIS] [get_bd_intf_pins axis_broadcaster_1/M11_AXIS]
connect_bd_intf_net [get_bd_intf_pins axis_broadcaster_1/M12_AXIS] [get_bd_intf_pins axis_switch_12/S02_AXIS]
connect_bd_intf_net [get_bd_intf_pins axis_switch_13/S02_AXIS] [get_bd_intf_pins axis_broadcaster_1/M13_AXIS]
connect_bd_intf_net [get_bd_intf_pins axis_broadcaster_1/M14_AXIS] [get_bd_intf_pins axis_switch_14/S02_AXIS]
connect_bd_intf_net [get_bd_intf_pins axis_switch_15/S02_AXIS] [get_bd_intf_pins axis_broadcaster_1/M15_AXIS]
connect_bd_intf_net [get_bd_intf_pins axi_interconnect_0/M08_AXI] [get_bd_intf_pins axis_switch_8/S_AXI_CTRL]
connect_bd_intf_net [get_bd_intf_pins axis_switch_9/S_AXI_CTRL] [get_bd_intf_pins axi_interconnect_0/M09_AXI]
connect_bd_intf_net [get_bd_intf_pins axi_interconnect_0/M10_AXI] [get_bd_intf_pins axis_switch_10/S_AXI_CTRL]
connect_bd_intf_net [get_bd_intf_pins axis_switch_11/S_AXI_CTRL] [get_bd_intf_pins axi_interconnect_0/M11_AXI]
connect_bd_intf_net [get_bd_intf_pins axis_switch_12/S_AXI_CTRL] [get_bd_intf_pins axi_interconnect_0/M12_AXI]
connect_bd_intf_net [get_bd_intf_pins axis_switch_13/S_AXI_CTRL] [get_bd_intf_pins axi_interconnect_0/M13_AXI]
connect_bd_intf_net [get_bd_intf_pins axis_switch_14/S_AXI_CTRL] [get_bd_intf_pins axi_interconnect_0/M14_AXI]
connect_bd_intf_net [get_bd_intf_pins axis_switch_15/S_AXI_CTRL] [get_bd_intf_pins axi_interconnect_0/M15_AXI]
connect_bd_intf_net [get_bd_intf_pins M00_AXIS] [get_bd_intf_pins axis_switch_0/M00_AXIS]
connect_bd_intf_net [get_bd_intf_pins M00_AXIS1] [get_bd_intf_pins axis_switch_1/M00_AXIS]
connect_bd_intf_net [get_bd_intf_pins M00_AXIS2] [get_bd_intf_pins axis_switch_2/M00_AXIS]
connect_bd_intf_net [get_bd_intf_pins S_AXIS] [get_bd_intf_pins axis_broadcaster_1/S_AXIS]
connect_bd_intf_net [get_bd_intf_pins M00_AXIS3] [get_bd_intf_pins axis_switch_3/M00_AXIS]
connect_bd_intf_net [get_bd_intf_pins M00_AXIS4] [get_bd_intf_pins axis_switch_4/M00_AXIS]
connect_bd_intf_net [get_bd_intf_pins S_AXIS1] [get_bd_intf_pins axis_broadcaster_2/S_AXIS]
connect_bd_intf_net [get_bd_intf_pins M00_AXIS5] [get_bd_intf_pins axis_switch_5/M00_AXIS]
connect_bd_intf_net [get_bd_intf_pins M00_AXIS6] [get_bd_intf_pins axis_switch_6/M00_AXIS]
connect_bd_intf_net [get_bd_intf_pins M00_AXIS7] [get_bd_intf_pins axis_switch_7/M00_AXIS]
connect_bd_intf_net [get_bd_intf_pins S_AXIS2] [get_bd_intf_pins axis_broadcaster_0/S_AXIS]
connect_bd_intf_net [get_bd_intf_pins S00_AXI] [get_bd_intf_pins axi_interconnect_0/S00_AXI]
